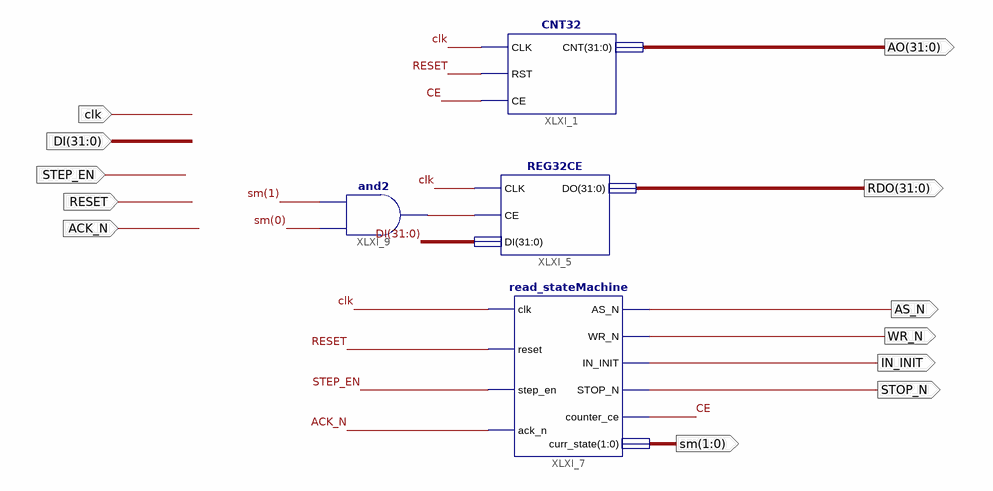
[diagram p0: schematic sheet 1]
// Xilinx ISE schematic read_machine.sch (spartan6) as structural Verilog: 4 symbols, 12 ports
module read_machine (
  input  STEP_EN,
  input  ACK_N,
  input  [31:0] DI,
  input  clk,
  input  RESET,
  output [31:0] RDO,
  output IN_INIT,
  output AS_N,
  output STOP_N,
  output WR_N,
  output [31:0] AO,
  output [1:0] sm
);

  wire CE, XLXN_32;

  REG32CE XLXI_5 (.CLK(clk), .CE(XLXN_32), .DI(DI), .DO(RDO));
  CNT32 XLXI_1 (.CLK(clk), .RST(RESET), .CE(CE), .CNT(AO));
  read_stateMachine XLXI_7 (
    .clk(clk), .reset(RESET), .step_en(STEP_EN), .ack_n(ACK_N), .AS_N(AS_N), .WR_N(WR_N), .IN_INIT(IN_INIT),
    .STOP_N(STOP_N), .counter_ce(CE), .curr_state(sm));
  and XLXI_9 (XLXN_32, sm[0], sm[1]);
endmodule
